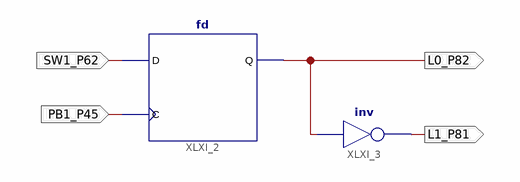
[diagram p0: schematic sheet 1]
// Xilinx ISE schematic Lab05_1.sch (spartan6) as structural Verilog: 2 symbols, 4 ports
module Lab05_1 (
  input  SW1_P62,
  input  PB1_P45,
  output L0_P82,
  output L1_P81
);

  fd XLXI_2 (.C(PB1_P45), .D(SW1_P62), .Q(L0_P82));
  not XLXI_3 (L1_P81, L0_P82);
endmodule
